# EAGLE design L3DCube_6x6x6_LED_Stick_Rev1.2 (EAGLE 7.6.0)
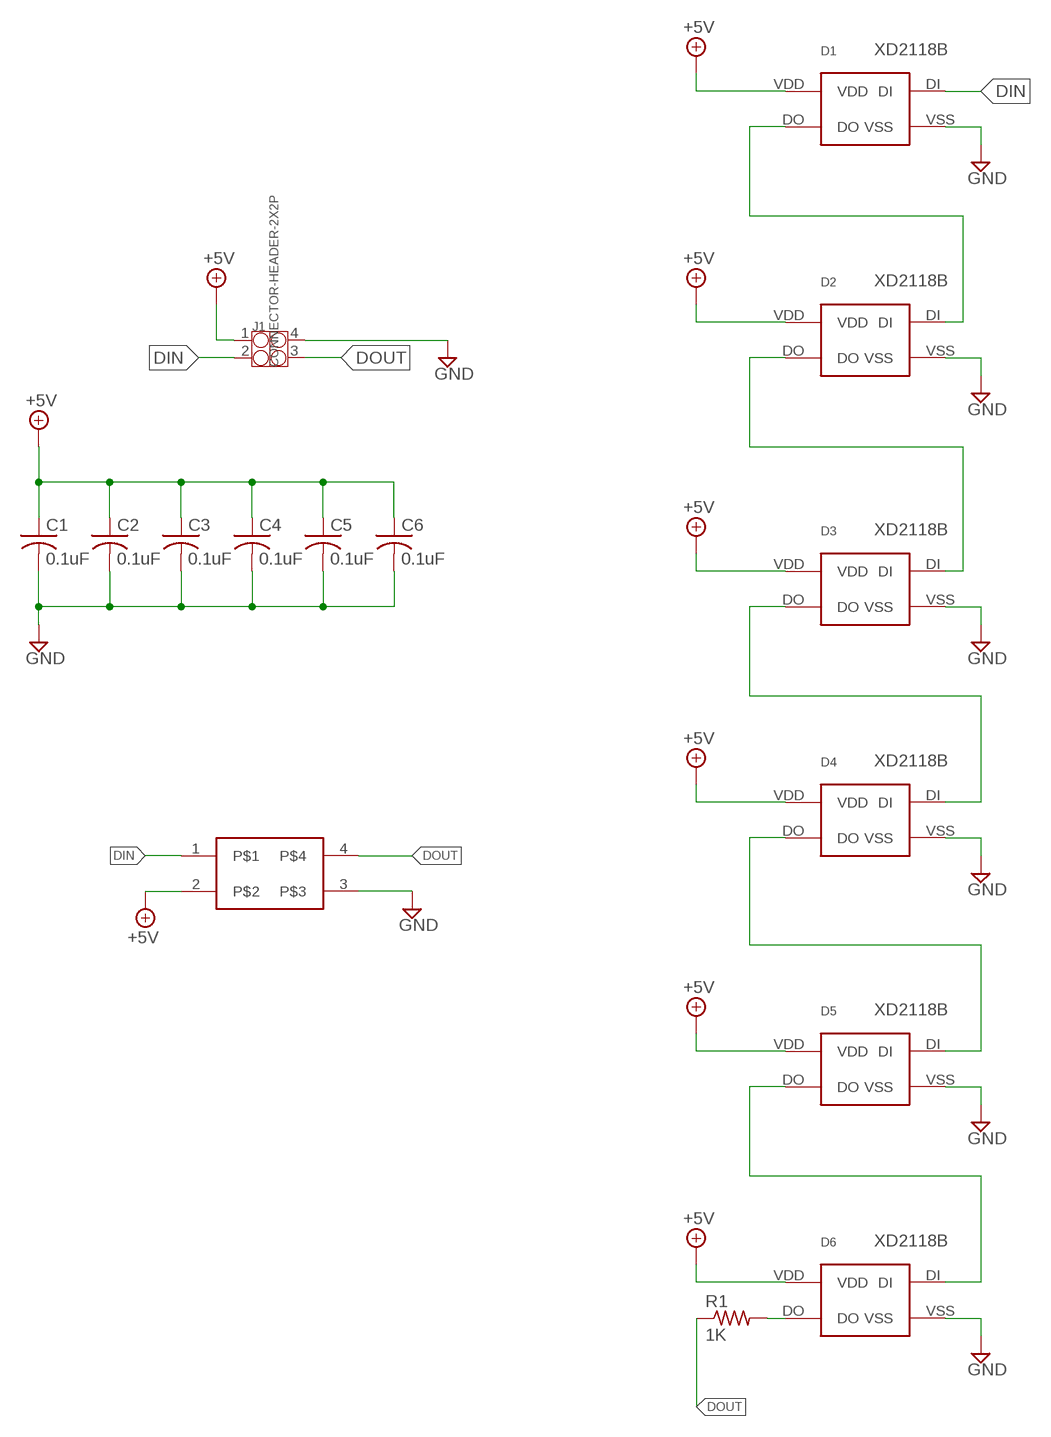
[diagram p0: schematic, sheet 1]

## Parts
C1  0.1uF  C-USC0402  [C0402]
C2  0.1uF  C-USC0402  [C0402]
C3  0.1uF  C-USC0402  [C0402]
C4  0.1uF  C-USC0402  [C0402]
C5  0.1uF  C-USC0402  [C0402]
C6  0.1uF  C-USC0402  [C0402]
D1  XD2118B  WS2812B  [WS2812B]
D2  XD2118B  WS2812B  [WS2812B]
D3  XD2118B  WS2812B  [WS2812B]
D4  XD2118B  WS2812B  [WS2812B]
D5  XD2118B  WS2812B  [WS2812B]
D6  XD2118B  WS2812B  [WS2812B]
J1  CONNECTOR-HEADER-2X2P  [2X2P-2.54]
R1  1K  R-US_R0402  [R0402]
U$1  TESTPAD-2X2-2.54  [2X2P-2.54-TESTPAD]

## Nets
+5V: C1.1 C2.1 C3.1 C4.1 C5.1 C6.1 D1.VDD D2.VDD D3.VDD D4.VDD D5.VDD D6.VDD J1.1 U$1.2
DIN: D1.DI J1.2 U$1.1
DOUT: J1.3 R1.1 U$1.4
GND: C1.2 C2.2 C3.2 C4.2 C5.2 C6.2 D1.VSS D2.VSS D3.VSS D4.VSS D5.VSS D6.VSS J1.4 U$1.3
N$1: D1.DO D2.DI
N$2: D2.DO D3.DI
N$3: D3.DO D4.DI
N$4: D4.DO D5.DI
N$5: D5.DO D6.DI
N$6: D6.DO R1.2

## Library data of the parts
C1-C6 = adafruit:C-US: CAPACITOR, American symbol
D1-D6 = lumex:WS2812B
J1 = OPL Eagle Library:CONNECTOR-HEADER-2X2P
R1 = adafruit:R-US_: RESISTOR, American symbol
U$1 = OPL Eagle Library:TESTPAD-2X2-2.54

## Board
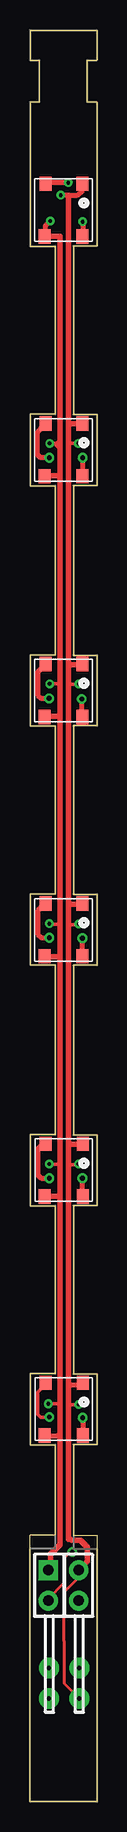
[diagram p1: board, top side]
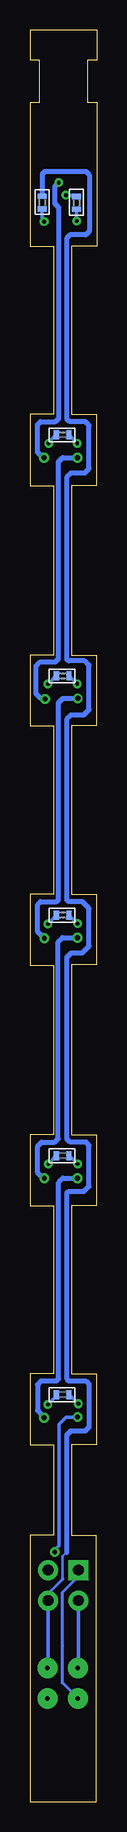
[diagram p2: board, bottom side, seen from below]

Size 5.61 x 147.65 mm. Coordinates in mm from the lower left corner, seen from the top.
Outline: 0,129.64 2.11,129.64 2.11,115.62 0.03,115.62 0.03,109.67 2.11,109.67 2.11,95.55 0.03,95.55 0.03,89.66 2.11,89.66 2.11,75.64 0.03,75.64 0.03,69.75 2.11,69.75 2.11,55.57 0.03,55.57 0.03,49.68 2.11,49.68 2.11,35.66 0.03,35.66 0.03,29.77 2.11,29.77 2.11,22.22 0.03,22.22 0.03,0 5.61,0 5.61,22.22 3.63,22.22 3.63,29.77 5.61,29.77 5.61,35.66 3.63,35.66 3.63,49.68 5.61,49.68 5.61,55.57 3.63,55.57 3.63,69.7 5.61,69.7 5.61,75.64 3.63,75.64 3.63,89.66 5.61,89.66 5.61,95.55 3.63,95.55 3.63,109.67 5.61,109.67 5.61,115.62 3.63,115.62 3.63,129.64 5.59,129.64 5.59,141.63 4.8,141.63 4.8,145.13 5.59,145.13 5.59,147.65 0,147.65 0,145.13 0.79,145.13 0.79,141.63 0,141.63 0,129.64
Copper layers (1*16): Top 0.035mm / dielectric 1.5mm / Bottom 0.035mm
Design rules "default": minimum track width 10mil, minimum drill 24mil, track to track 8mil, track to pad 8mil, pad to pad 8mil, via to via 8mil, smd to smd 8mil, copper to edge 40mil, drill to drill 8mil, minimum pad ring 10mil, minimum via ring 8mil, stop-mask expansion 4mil, vias tented up to drill 0mil, thermal gap 10mil

### Footprints (pad centres in the part's own frame; a part is rotated, then mirrored left to right if it is on the bottom)
C0402 = smd 0.432 x 0.762: 1 -0.533,0; 2 0.533,0
WS2812B = smd 1.2 x 1: DI 4.4,-0.1; DO 0,-3.2; VDD 0,0; VSS 4.4,-3.2
2X2P-2.54 = drill 0.889 pad 1.651 square: 1 -1.27,1.27 | drill 0.889 pad 1.651: 2 -1.27,-1.27; 3 1.27,-1.27; 4 1.27,1.27
R0402 = smd 0.432 x 0.762: 1 -0.533,0; 2 0.533,0
2X2P-2.54-TESTPAD = drill 0.381 pad 1.676: 1 0,0; 2 0,-2.54; 3 2.54,-2.54; 4 2.54,0

### Placement (x,y rotation side)
C1  2.87,33.93 180 bottom
C2  2.87,53.85 180 bottom
C3  2.87,73.89 180 bottom
C4  2.87,93.83 180 bottom
C5  2.87,113.92 180 bottom
C6  1.7,133.25 90 bottom
D1  1.22,30.52 90 top
D2  1.22,50.43 90 top
D3  1.22,70.46 90 top
D4  1.22,90.41 90 top
D5  1.22,110.46 90 top
D6  1.22,130.44 90 top
J1  2.82,18.03 0 top
R1  4.57,133.27 270 bottom
U$1  1.6,11.15 0 top

### Tracks (layer width: path | path; a pad name or v marks a point on that pad's centre or on a via)
+5V  (via drill 0.3)
  Top 0.305: 2.21,113.21 2.24,113.23 | 2.51,33.09 2.44,33.17 v1.55,33.17 | 2.51,113.51 2.24,113.23 | 2.24,113.23 2.24,113.18 2.21,113.21 | 2.21,113.21 v1.65,113.21 | 1.25,90.45 1.33,90.52 2.49,90.52 2.49,93.06 2.39,93.16 v1.65,93.16 | D2.VDD 2.48,50.43 2.54,50.49 2.54,53.11 1.68,53.11 v1.63,53.16 | D3.VDD 2.54,70.46 2.54,73.1 2.51,73.12 1.68,73.12 v1.63,73.17
  Top 0.406: 2.26,113.08 2.51,112.82 | D1.VDD 2.34,30.52 2.51,30.35 | 1.33,130.48 1.33,131.38 v1.7,131.72
  Top 0.457: 2.51,50.44 2.51,70.43 | 2.51,70.43 2.51,73.12 2.51,90.45 | 2.51,90.45 2.51,110.51 | 2.51,110.51 2.51,112.82 2.51,113.51 2.51,130.48 1.33,130.48 D6.VDD | D2.VDD 1.25,50.44 2.51,50.44 | D3.VDD 1.25,70.43 2.51,70.43 | D4.VDD 1.25,90.45 2.51,90.45 | D5.VDD 1.32,110.51 2.51,110.51 | 2.51,50.44 2.51,33.09 2.51,30.35 2.51,21.44 1.73,20.65 1.73,19.48 J1.1
  Bottom 0.254: U$1.2 2.9,9.9 2.9,13 2.87,13.03 2.87,17.47 1.55,18.79 J1.1
  Bottom 0.305: 1.65,33.17 v1.55,33.17 2.31,33.93 C1.1 | v1.7,131.72 C6.1 | C5.1 1.65,113.23 v1.65,113.21 | C4.1 1.68,93.16 v1.65,93.16 | C3.1 v1.63,73.17 | C2.1 2.31,53.85 v1.63,53.16
DIN  (via drill 0.38)
  Top 0.203: J1.2 1.57,16.76 | 2.87,18.69 2.87,20.27 3.43,20.83
  Top 0.254: 1.57,16.76 1.57,16.94 2.87,18.23 2.87,18.69
  Top 0.305: v1.63,32.05 0.89,32.05 0.66,32.28 0.66,34.14 1.32,34.8 D1.DI | 3.43,20.83 v3.53,20.83
  Bottom 0.305: v1.63,32.05 2.57,32.05 3.17,31.44 3.17,21.33 3.53,20.98 v3.53,20.83 | U$1.1 1.55,11.2 J1.2
DOUT
  Bottom 0.203: 2.54,20.77 2.87,20.44 2.87,18.62
  Bottom 0.254: J1.3 4.09,17.32 2.87,18.54 2.87,18.62
  Bottom 0.305: U$1.4 4.09,11.2 J1.3
  Bottom 0.406: 2.54,20.77 2.54,30.55 2.21,30.88 0.99,30.88 0.66,31.21 0.66,34.8 0.94,35.07 2.36,35.07 2.54,35.25 2.54,50.7 2.36,50.87 1.07,50.87 0.66,51.28 0.66,54.71 0.91,54.96 2.24,54.96 2.54,55.27 2.54,70.33 2.13,70.74 1.22,70.74 0.66,71.3 0.66,74.44 1.22,75 2.34,75 2.54,75.21 2.54,90.19 2.18,90.55 1.12,90.55 0.66,91.01 0.66,94.71 1.02,95.07 2.36,95.07 2.54,95.25 2.54,110.36 2.18,110.72 1.04,110.72 0.66,111.1 0.66,114.7 0.97,115.01 2.29,115.01 2.54,115.26 2.54,130.27 2.24,130.58 0.94,130.58 0.63,130.88 0.63,135.58 0.89,135.84 4.37,135.84 4.57,135.63 R1.1
GND  (via drill 0.3)
  Top 0.254: U$1.3 2.9,9.85 2.9,13.36 2.87,13.38 2.87,17.47 4.09,18.69 J1.4
  Top 0.305: 3.25,113.26 3.3,113.21 v4.04,113.21 | 3.25,93.09 3.3,93.14 v4.09,93.14 | 3.3,34.72 3.3,33.07 3.28,33.04 3.28,33.09 4.06,33.09 v4.09,33.12 | 3.28,53.06 3.3,53.06 3.33,53.08 3.99,53.08 v4.06,53.16 | 3.25,73.1 4.04,73.1 v4.09,73.15
  Top 0.406: 3.25,113.26 3.23,113.23 | 3.25,93.09 3.23,93.06 | 4.01,113.26 v4.04,113.21 | 3.25,73.1 3.23,73.07 | 3.28,53.06 3.23,53.01 | 4.39,34.72 3.3,34.72 3.23,34.8 | v2.59,133.88 3.23,133.88 3.99,133.88 4.42,134.31 D6.VSS
  Top 0.457: 3.23,21.99 3.23,21.87 3.51,21.79 | 3.23,21.99 3.23,34.8 3.23,53.01 3.23,54.79 | 3.23,54.79 3.23,73.07 3.23,74.8 | 3.23,74.8 3.23,93.06 3.23,94.76 | 3.23,94.76 3.23,113.23 3.23,114.83 | 3.23,114.83 3.23,133.88 | 4.35,34.87 D1.VSS 4.39,34.72 | D2.VSS 4.4,54.79 3.23,54.79 | D3.VSS 4.36,74.8 3.23,74.8 | D4.VSS 4.37,94.76 3.23,94.76 | D5.VSS 4.44,114.83 3.23,114.83 | D6.VSS 4.4,134.74 | J1.4 4.83,20.04 4.83,21.21 4.24,21.79 3.51,21.79 | 3.51,21.79 3.23,21.99
  Bottom 0.305: C6.2 2.08,133.78 2.18,133.88 v2.59,133.88 | C5.2 4.04,113.28 v4.04,113.21 | C4.2 v4.09,93.14 | C3.2 3.4,73.84 v4.09,73.15 | C2.2 3.4,53.82 v4.06,53.16 | C1.2 3.4,33.8 v4.09,33.12
N$1  (via drill 0.41)
  Top 0.406: 4.37,30.75 D1.DO v4.42,32 | D2.DI 1.12,54.83 0.66,54.38 0.66,52.25 0.94,51.97 v1.63,51.97
  Top 0.457: 4.34,30.77 D1.DO
  Bottom 0.406: v1.63,51.97 2.84,51.97 3.2,51.61 3.2,35.25 3.4,35.05 4.7,35.05 4.98,34.77 4.98,32.61 v4.42,32
N$2  (via drill 0.41)
  Top 0.406: D2.DO 4.39,50.69 v4.39,51.97 | D3.DI 1.28,74.86 0.66,74.24 0.66,72.31 0.97,72.01 v1.63,72.01
  Bottom 0.406: v1.63,72.01 2.9,72.01 3.25,71.65 3.25,55.24 3.53,54.96 4.62,54.96 4.95,54.63 4.95,52.42 4.5,51.97 v4.39,51.97
N$3  (via drill 0.41)
  Top 0.406: D3.DO 4.39,70.48 v4.39,71.96 | D4.DI 1.32,94.79 0.66,94.13 0.66,92.22 0.94,91.95 v1.6,91.95
  Bottom 0.406: v1.6,91.95 2.84,91.95 3.23,91.56 3.23,75.16 3.38,75 4.72,75 4.95,74.78 4.95,72.49 4.47,72.01 v4.39,71.96
N$4  (via drill 0.41)
  Top 0.406: D4.DO 4.37,90.46 4.37,91.92 v4.34,91.89 | v1.63,112.01 0.89,112.01 0.66,112.24 0.66,114.15 0.76,114.26 D5.DI
  Bottom 0.406: v1.63,112.01 2.87,112.01 3.23,111.66 3.23,95.25 3.48,94.99 4.75,94.99 5.11,94.64 5.11,92.35 4.7,91.95 v4.34,91.89
N$5  (via drill 0.3, 0.41)
  Top 0.305: D6.DI 1.19,134.71
  Top 0.406: D5.DO 4.42,110.51 v4.42,112.01 | 1.19,134.71 1.19,135.02 | v3.2,134.92 1.4,134.92 D6.DI
  Bottom 0.406: v4.42,112.01 4.52,112.01 4.98,112.47 4.98,114.75 4.72,115.01 3.45,115.01 3.3,115.16 3.2,115.26 3.2,132.86 3.51,133.17 3.51,134.62 v3.2,134.92
N$6  (via drill 0.3)
  Top 0.406: v4.42,131.67 D6.DO
  Bottom 0.305: 4.57,131.82 R1.2
  Bottom 0.406: 4.57,131.82 v4.42,131.67

### Text on the board
tPlace: XD2118B
tValues: XD2118B | XD2118B | XD2118B | XD2118B | XD2118B | XD2118B | 6x6x6 的版本LED用XD2118B